# EAGLE design PolluxWakeupShield (EAGLE 6.1)
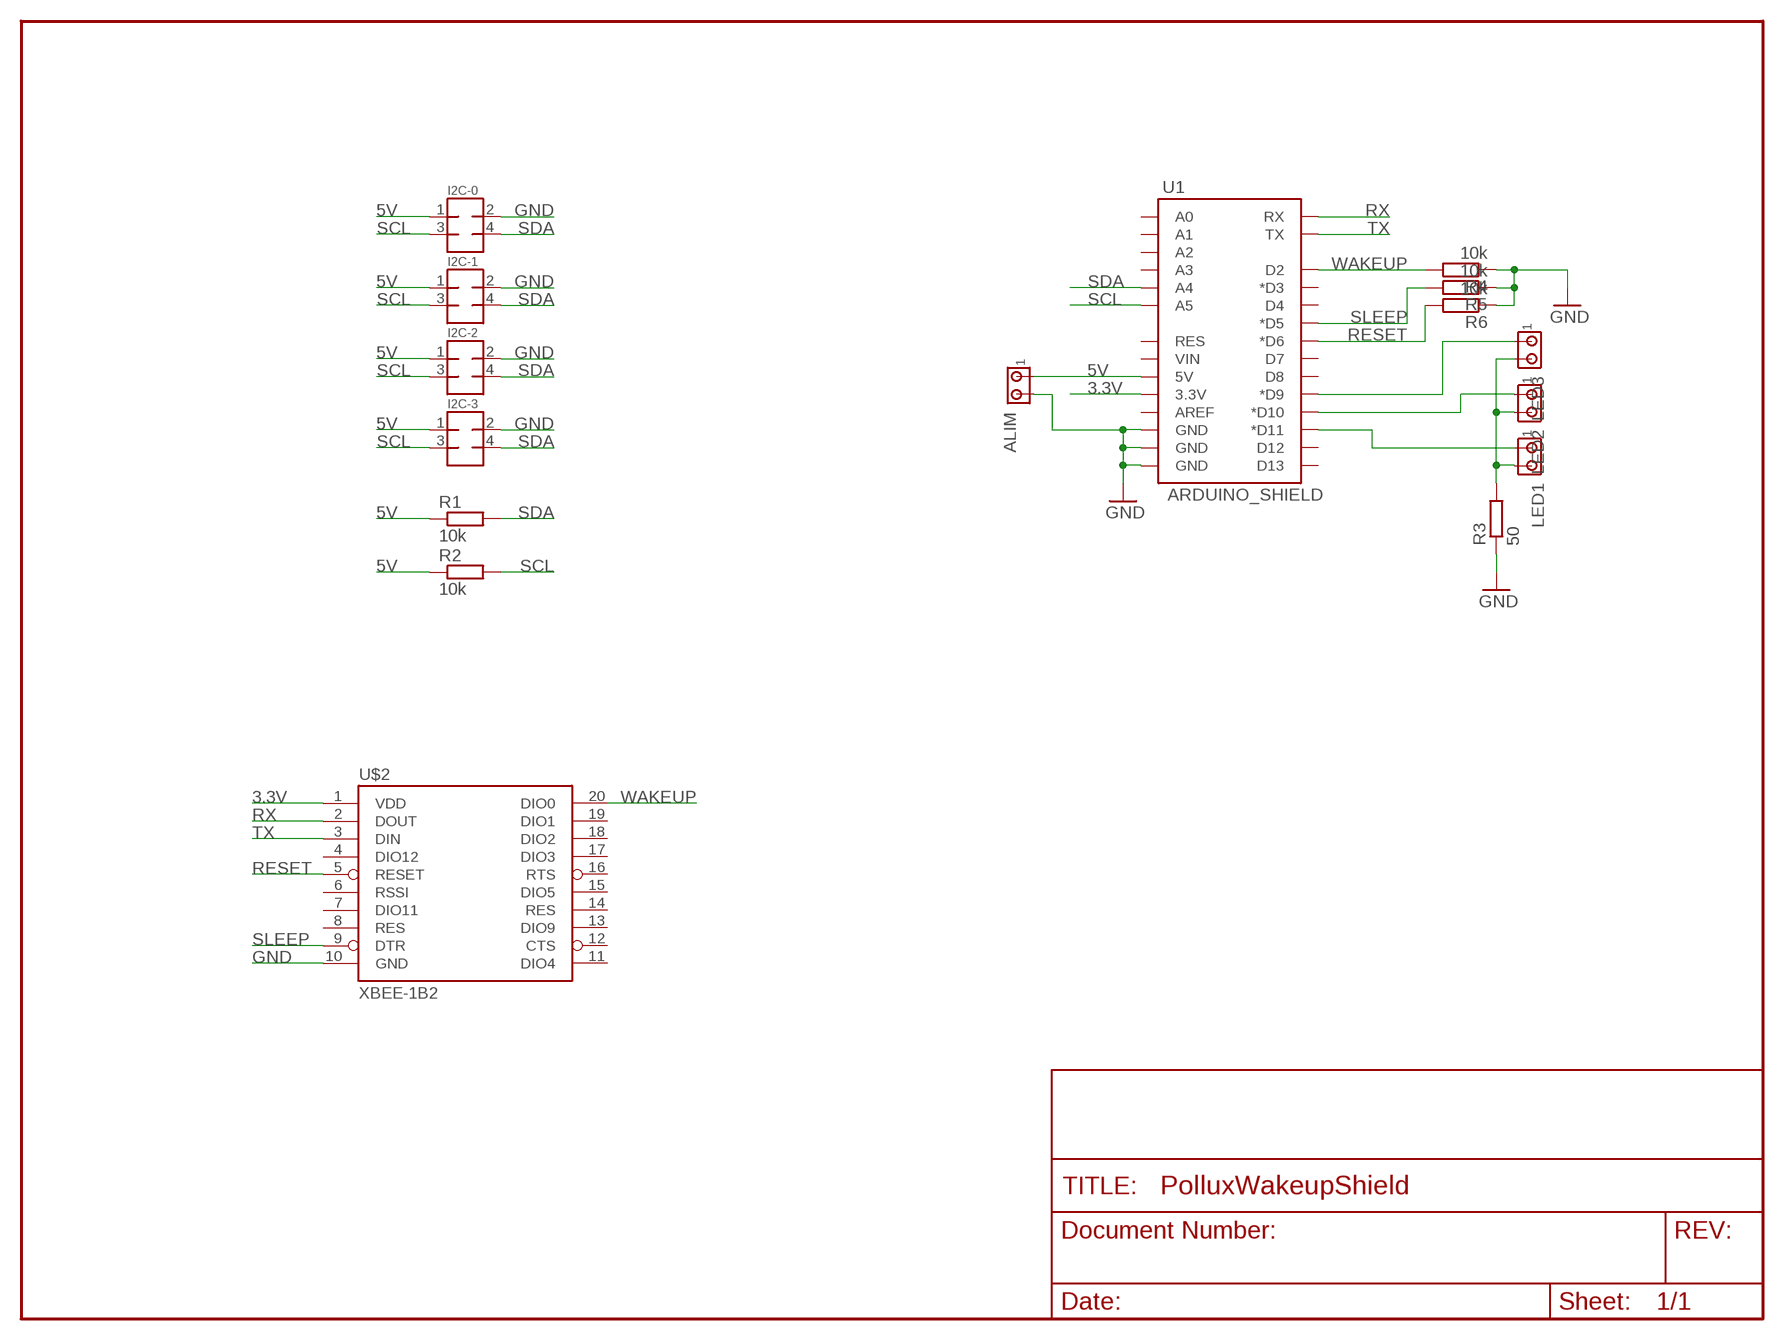
[diagram p0: schematic, sheet 1]

## Parts
ALIM  MTA02-100  [10X02MTA]
I2C-0  MMATCH-4-PTH  [AMP-215079-4]
I2C-1  MMATCH-4-PTH  [AMP-215079-4]
I2C-2  MMATCH-4-PTH  [AMP-215079-4]
I2C-3  MMATCH-4-PTH  [AMP-215079-4]
LED1  MTA02-100  [10X02MTA]
LED2  MTA02-100  [10X02MTA]
LED3  MTA02-100  [10X02MTA]
R1  10k  R-EU_0204/7  [0204/7]
R2  10k  R-EU_0204/7  [0204/7]
R3  50  R-EU_0204/7  [0204/7]
R4  10k  R-EU_0204/7  [0204/7]
R5  10k  R-EU_0204/7  [0204/7]
R6  10k  R-EU_0204/7  [0204/7]
U1  ARDUINO_SHIELD  ARDUINO_SHIELDLABEL  [DUEMILANOVE_SHIELD]
U$2  XBEE-1B2  [XBEE-SILK]

## Nets
3.3V: U1.3.3V U$2.1(VDD)
5V: ALIM.1 I2C-0.1 I2C-1.1 I2C-2.1 I2C-3.1 R1.1 R2.1 U1.5V
GND: ALIM.2 I2C-0.2 I2C-1.2 I2C-2.2 I2C-3.2 R3.1 R4.1 R5.1 R6.1 U1.GND@0(GND) U1.GND@1(GND) U1.GND@2(GND) U$2.10(GND)
N$1: LED1.2 LED2.2 LED3.2 R3.2
N$2: LED3.1 U1.D9(*D9)
N$3: LED2.1 U1.D10(*D10)
N$4: LED1.1 U1.D11(*D11)
RESET: R6.2 U1.D6(*D6) U$2.5(RESET)
RX: U1.RX U$2.2(DOUT)
SCL: I2C-0.3 I2C-1.3 I2C-2.3 I2C-3.3 R2.2 U1.A5
SDA: I2C-0.4 I2C-1.4 I2C-2.4 I2C-3.4 R1.2 U1.A4
SLEEP: R5.2 U1.D5(*D5) U$2.9(DTR)
TX: U1.TX U$2.3(DIN)
WAKEUP: R4.2 U1.D2 U$2.20(DIO0)
Unconnected: U1.A0 U1.A1 U1.A2 U1.A3 U1.AREF U1.D3(*D3) U1.D4 U1.D7 U1.D8 U1.D12 U1.D13 U1.RES U1.VIN U$2.4(DIO12) U$2.6(RSSI) U$2.7(DIO11) U$2.8(RES) U$2.11(DIO4) U$2.12(CTS) U$2.13(DIO9) U$2.14(RES) U$2.15(DIO5) U$2.16(RTS) U$2.17(DIO3) U$2.18(DIO2) U$2.19(DIO1)

## Library data of the parts
ALIM LED1-LED3 = con-amp:MTA02-100: AMP connector
I2C-0 I2C-1-I2C-3 = hackabledevices:MMATCH-4-*: AMP Micromatch 4-pin
R1-R6 = praagma:R-EU_: RESISTOR, European symbol
U1 = SparkFun:ARDUINO_SHIELD
U$2 = praagma:XBEE-1

## Board
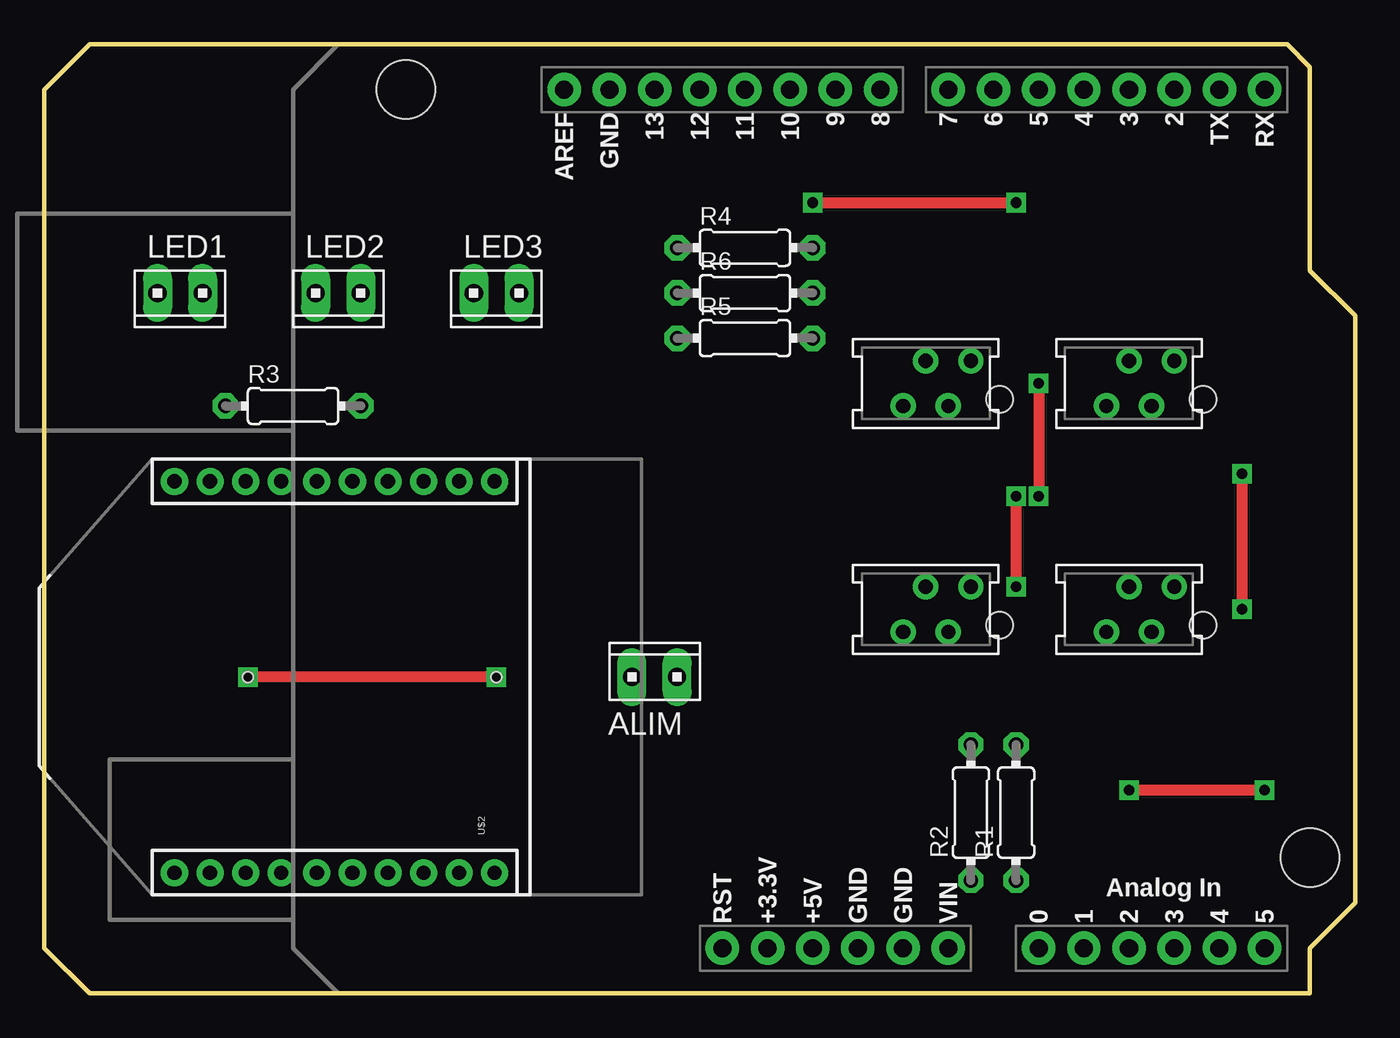
[diagram p1: board, top side]
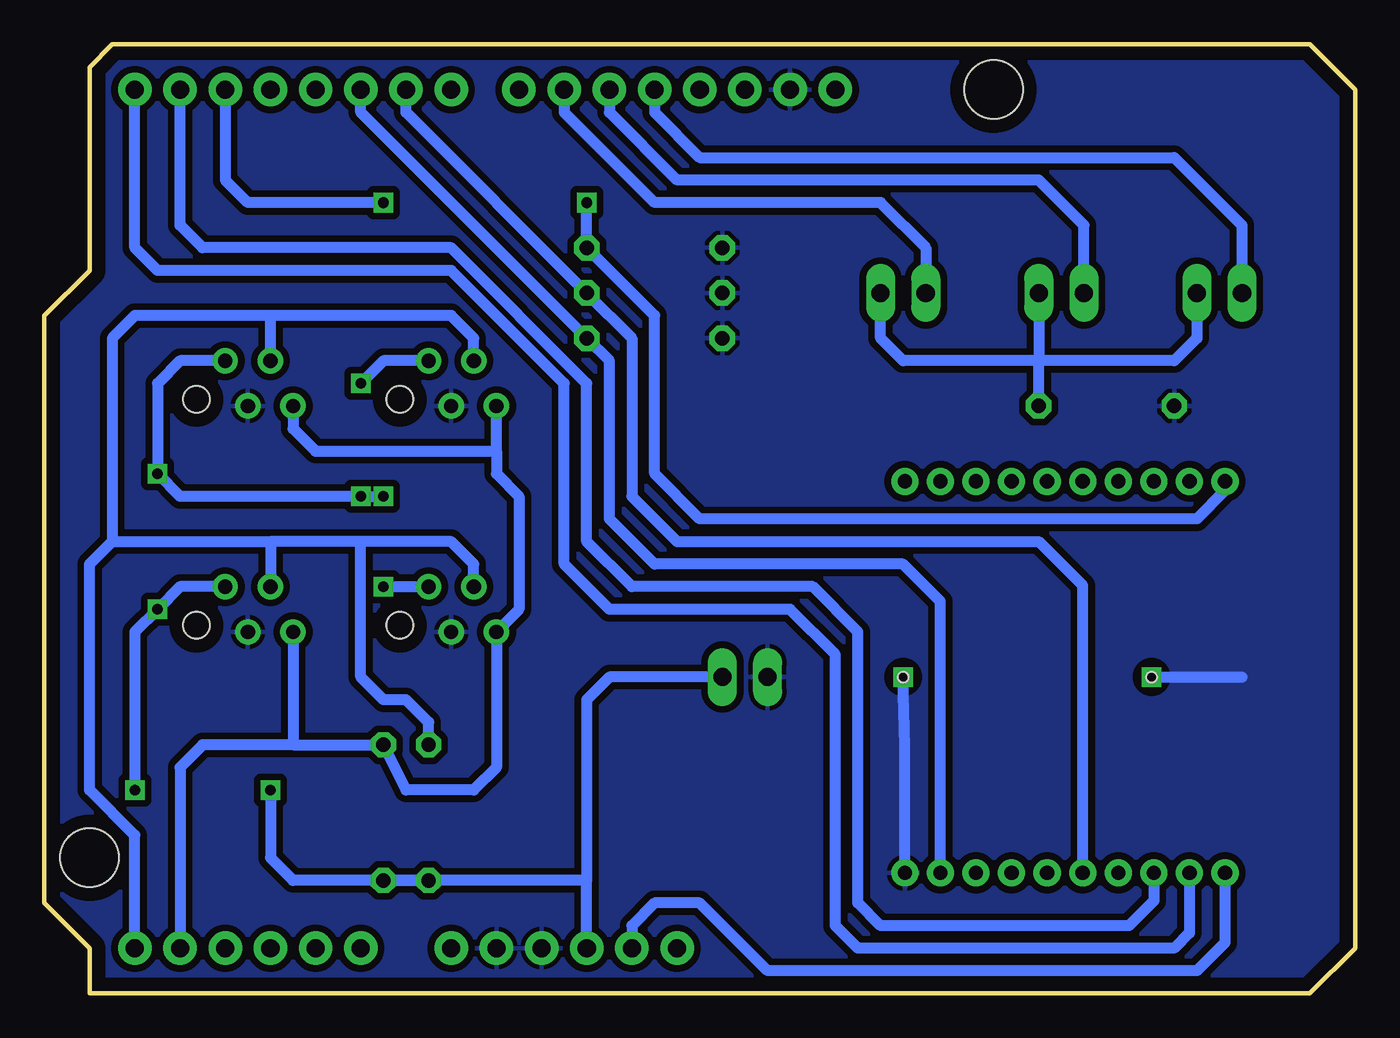
[diagram p2: board, bottom side, seen from below]

Size 73.66 x 53.34 mm. Coordinates in mm from the lower left corner, seen from the top.
Outline: 2.54,53.34 69.85,53.34 71.12,52.07 71.12,40.64 73.66,38.1 73.66,5.08 71.12,2.54 71.12,0 2.54,0 0,2.54 0,50.8 2.54,53.34
Copper layers (1*16): Top 0.035mm / dielectric 1.5mm / Bottom 0.035mm
Design rules: minimum track width 30mil, minimum drill 20mil, track to track 15mil, track to pad 15mil, pad to pad 8mil, via to via 15mil, smd to smd 15mil, copper to edge 30mil, drill to drill 8mil, minimum pad ring 12mil, minimum via ring 10mil, stop-mask expansion 4mil, vias tented up to drill 25mil, thermal gap 10mil
Holes 0.6 mm at 11.43,17.78 25.4,17.78
tRestrict: area 35.6,17.8 to 41.9,22.9; area 35.6,33 to 41.9,38.1; area 58.4,17.8 to 64.8,22.9; area 58.4,33 to 64.8,38.1

### Footprints (pad centres in the part's own frame; a part is rotated, then mirrored left to right if it is on the bottom)
10X02MTA = drill 1.016 long: 1 1.27,0; 2 -1.27,0
AMP-215079-4 = drill 0.8 pad 1.422: 1 0,-1.27; 2 1.27,1.27; 3 2.54,-1.27; 4 3.81,1.27 | hole 1.5: -1.62,0.905
0204/7 = drill 0.813 octagon: 1 -3.81,0; 2 3.81,0
DUEMILANOVE_SHIELD = drill 1.016 pad 1.88: 3.3V 50.8,26.67; 5V 50.8,29.21; A0 50.8,41.91; A1 50.8,44.45; A2 50.8,46.99; A3 50.8,49.53; A4 50.8,52.07; A5 50.8,54.61; AREF 2.54,15.24; D2 2.54,49.53; D3 2.54,46.99; D4 2.54,44.45; D5 2.54,41.91; D6 2.54,39.37; D7 2.54,36.83; D8 2.54,33.02; D9 2.54,30.48; D10 2.54,27.94; D11 2.54,25.4; D12 2.54,22.86; D13 2.54,20.32; GND@0 50.8,31.75; GND@1 50.8,34.29; GND@2 2.54,17.78; RES 50.8,24.13; RX 2.54,54.61; TX 2.54,52.07; VIN 50.8,36.83 | hole 3.302: 45.72,57.15; 2.54,6.35
XBEE-SILK = drill 0.8 pad 1.524: 1 -11,20; 2 -11,18; 3 -11,16; 4 -11,14; 5 -11,12; 6 -11,10; 7 -11,8; 8 -11,6; 9 -11,4; 10 -11,2; 11 11,2; 12 11,4; 13 11,6; 14 11,8; 15 11,10; 16 11,12; 17 11,14; 18 11,16; 19 11,18; 20 11,20

### Placement (x,y rotation side)
ALIM  34.29,17.78 0 top
I2C-0  63.5,21.59 180 top
I2C-1  52.07,21.59 180 top
I2C-2  52.07,34.29 180 top
I2C-3  63.5,34.29 180 top
LED1  7.62,39.37 180 top
LED2  16.51,39.37 180 top
LED3  25.4,39.37 180 top
R1  54.61,10.16 90 top
R2  52.07,10.16 90 top
R3  13.97,33.02 0 top
R4  39.37,41.91 0 top
R5  39.37,36.83 0 top
R6  39.37,39.37 0 top
U1  13.97,53.34 270 top
U$2  27.31,17.78 90 top

### Tracks (layer width: path | path; a pad name or v marks a point on that pad's centre or on a via)
3.3V
  Bottom 0.61: U$2.1 7.3,2.85 8.89,1.27 33.02,1.27 36.83,5.08 39.37,5.08 40.64,3.81 U1.3.3V
5V  (via drill 0.6)
  Top 0.61: v54.61,27.94 v54.61,22.86 | v55.88,34.29 v55.88,27.94 | v67.31,29.21 v67.31,21.59 | v60.96,11.43 v68.58,11.43
  Bottom 0.61: R1.1 R2.1 | I2C-3.1 66.04,35.56 67.31,34.29 v67.31,29.21 66.04,27.94 v55.88,27.94 v54.61,27.94 | v54.61,22.86 I2C-1.1 | I2C-2.1 54.61,35.56 v55.88,34.29 | R2.1 59.69,6.35 60.96,7.62 v60.96,11.43 | U1.5V 43.18,6.35 | 43.18,6.35 R2.1 | I2C-0.1 66.04,22.86 v67.31,21.59 68.58,20.32 v68.58,11.43 | ALIM.1 41.91,17.78 43.18,16.51 43.18,6.35
GND  (via drill 0.6)
  Top 0.61: v25.4,17.78 v11.43,17.78
  Bottom 0.61: U$2.10 25.31,13.87 v25.4,17.78 | v11.43,17.78 6.35,17.78
  pour Bottom (isolate 0.305): 2.54,53.34 69.85,53.34 71.12,52.07 71.12,40.64 73.66,38.1 73.66,5.08 71.12,2.54 71.12,0 2.54,0 0,2.54 0,50.8
N$1
  Bottom 0.61: LED1.2 8.89,36.83 10.16,35.56 17.78,35.56 | 17.78,35.56 25.4,35.56 26.67,36.83 LED3.2 | LED2.2 17.78,35.56 | R3.2 17.78,35.56
N$2
  Bottom 0.61: LED3.1 24.13,41.91 26.67,44.45 39.37,44.45 44.45,49.53 U1.D9
N$3
  Bottom 0.61: LED2.1 15.24,43.18 17.78,45.72 38.1,45.72 41.91,49.53 U1.D10
N$4
  Bottom 0.61: LED1.1 6.35,43.18 10.16,46.99 36.83,46.99 39.37,49.53 U1.D11
RESET
  Bottom 0.61: U$2.5 15.3,22.93 17.78,25.4 38.1,25.4 40.64,27.94 40.64,36.83 R6.2 53.34,49.53 U1.D6
RX
  Bottom 0.61: U$2.2 9.3,3.4 10.16,2.54 27.94,2.54 29.21,3.81 29.21,19.05 31.75,21.59 41.91,21.59 44.45,24.13 44.45,34.29 50.8,40.64 67.31,40.64 68.58,41.91 U1.RX
SCL
  Bottom 0.61: R2.2 52.07,15.24 53.34,16.51 54.61,16.51 55.88,17.78 55.88,25.4 | 55.88,25.4 60.96,25.4 | 60.96,25.4 I2C-0.3 | I2C-1.3 49.53,24.13 50.8,25.4 55.88,25.4 | I2C-3.3 60.96,38.1 | 60.96,38.1 68.58,38.1 69.85,36.83 69.85,25.4 | 69.85,25.4 60.96,25.4 | I2C-2.3 49.53,36.83 50.8,38.1 60.96,38.1 | U1.A5 68.58,8.89 71.12,11.43 71.12,24.13 69.85,25.4
SDA
  Bottom 0.61: I2C-0.4 59.69,13.97 | 59.69,13.97 R1.2 53.34,11.43 49.53,11.43 48.26,12.7 I2C-1.4 46.99,21.59 46.99,27.94 48.26,29.21 48.26,30.48 | I2C-3.4 59.69,31.75 58.42,30.48 48.26,30.48 | 48.26,30.48 I2C-2.4 | 59.69,13.97 64.77,13.97 66.04,12.7 U1.A4
SLEEP
  Bottom 0.61: U$2.9 23.31,22.04 25.4,24.13 39.37,24.13 41.91,26.67 41.91,35.56 R5.2 55.88,49.53 U1.D5
TX
  Bottom 0.61: U$2.3 11.3,5.21 12.7,3.81 26.67,3.81 27.94,5.08 27.94,20.32 30.48,22.86 40.64,22.86 43.18,25.4 43.18,34.29 50.8,41.91 64.77,41.91 66.04,43.18 U1.TX
WAKEUP  (via drill 0.6)
  Top 0.61: v43.18,44.45 v54.61,44.45
  Bottom 0.61: U$2.20 7.3,28.25 8.89,26.67 36.83,26.67 39.37,29.21 39.37,38.1 R4.2 v43.18,44.45 | v54.61,44.45 62.23,44.45 63.5,45.72 U1.D2